# EAGLE design makey_makey_modify_v2 (EAGLE 7.2.0)
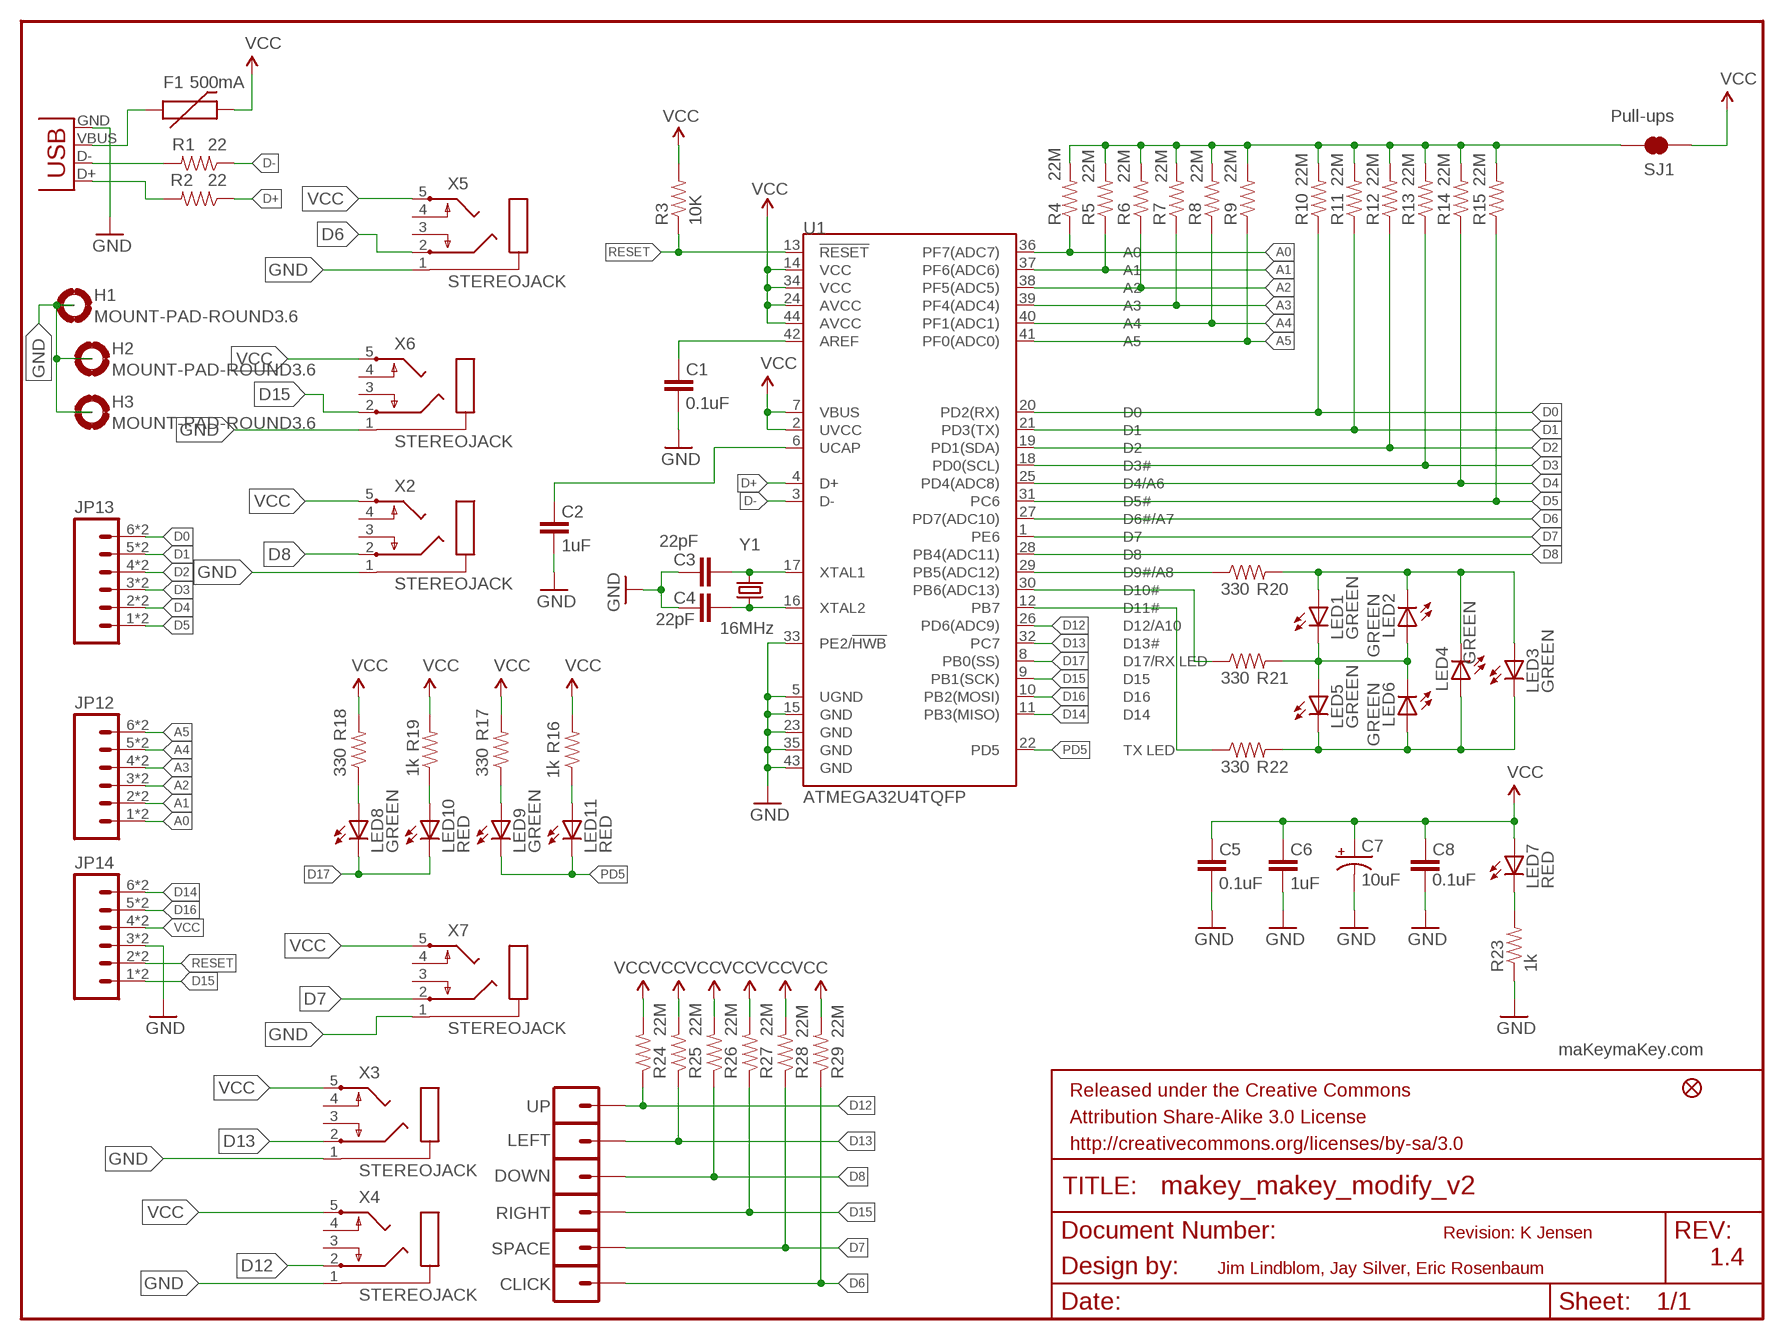
[diagram p0: schematic, sheet 1]

## Parts
C1  0.1uF  CAP0603-CAP  [0603-CAP]
C2  1uF  CAP0603-CAP  [0603-CAP]
C3  22pF  CAP0603-CAP  [0603-CAP]
C4  22pF  CAP0603-CAP  [0603-CAP]
C5  0.1uF  CAP0603-CAP  [0603-CAP]
C6  1uF  CAP0603-CAP  [0603-CAP]
C7  10uF  CAP_POL1206  [EIA3216]
C8  0.1uF  CAP0603-CAP  [0603-CAP]
CLICK  M01ALLIGATOR-3MM  [1X01_ALLIGATOR_3MM]
DOWN  M01ALLIGATOR-3MM  [1X01_ALLIGATOR_3MM]
F1  500mA  PTCSMD-W  [PTC-1206-WIDE]
H1  MOUNT-PAD-ROUND3.6  [3,6-PAD]
H2  MOUNT-PAD-ROUND3.6  [3,6-PAD]
H3  MOUNT-PAD-ROUND3.6  [3,6-PAD]
JP2  FIDUCIALUFIDUCIAL  [MICRO-FIDUCIAL]
JP12  M06SMD-STRAIGHT-COMBO  [1X06_SMD_STRAIGHT_COMBO]
JP13  M06SMD-STRAIGHT-COMBO  [1X06_SMD_STRAIGHT_COMBO]
JP14  M06SMD-STRAIGHT-COMBO  [1X06_SMD_STRAIGHT_COMBO]
LED1  GREEN  LED1206-BOTTOM  [LED-1206-BOTTOM]
LED2  GREEN  LED1206-BOTTOM  [LED-1206-BOTTOM]
LED3  GREEN  LED1206-BOTTOM  [LED-1206-BOTTOM]
LED4  GREEN  LED1206-BOTTOM  [LED-1206-BOTTOM]
LED5  GREEN  LED1206-BOTTOM  [LED-1206-BOTTOM]
LED6  GREEN  LED1206-BOTTOM  [LED-1206-BOTTOM]
LED7  RED  LED0603  [LED-0603]
LED8  GREEN  LED0603  [LED-0603]
LED9  GREEN  LED0603  [LED-0603]
LED10  RED  LED0603  [LED-0603]
LED11  RED  LED0603  [LED-0603]
LEFT  M01ALLIGATOR-3MM  [1X01_ALLIGATOR_3MM]
R1  22  RESISTOR0603-RES  [0603-RES]
R2  22  RESISTOR0603-RES  [0603-RES]
R3  10K  RESISTOR0603-RES  [0603-RES]
R4  22M  RESISTOR0603-RES  [0603-RES]
R5  22M  RESISTOR0603-RES  [0603-RES]
R6  22M  RESISTOR0603-RES  [0603-RES]
R7  22M  RESISTOR0603-RES  [0603-RES]
R8  22M  RESISTOR0603-RES  [0603-RES]
R9  22M  RESISTOR0603-RES  [0603-RES]
R10  22M  RESISTOR0603-RES  [0603-RES]
R11  22M  RESISTOR0603-RES  [0603-RES]
R12  22M  RESISTOR0603-RES  [0603-RES]
R13  22M  RESISTOR0603-RES  [0603-RES]
R14  22M  RESISTOR0603-RES  [0603-RES]
R15  22M  RESISTOR0603-RES  [0603-RES]
R16  1k  RESISTOR0603-RES  [0603-RES]
R17  330  RESISTOR0603-RES  [0603-RES]
R18  330  RESISTOR0603-RES  [0603-RES]
R19  1k  RESISTOR0603-RES  [0603-RES]
R20  330  RESISTOR0603-RES  [0603-RES]
R21  330  RESISTOR0603-RES  [0603-RES]
R22  330  RESISTOR0603-RES  [0603-RES]
R23  1k  RESISTOR0603-RES  [0603-RES]
R24  22M  RESISTOR0603-RES  [0603-RES]
R25  22M  RESISTOR0603-RES  [0603-RES]
R26  22M  RESISTOR0603-RES  [0603-RES]
R27  22M  RESISTOR0603-RES  [0603-RES]
R28  22M  RESISTOR0603-RES  [0603-RES]
R29  22M  RESISTOR0603-RES  [0603-RES]
RIGHT  M01ALLIGATOR-3MM  [1X01_ALLIGATOR_3MM]
SJ1  Pull-ups  SOLDERJUMPER-OLDTRACE  [SJ_2S-TRACE]
SPACE  M01ALLIGATOR-3MM  [1X01_ALLIGATOR_3MM]
U1  ATMEGA32U4TQFP  [TQFP44]
UP  M01ALLIGATOR-3MM  [1X01_ALLIGATOR_3MM]
X1  USBSMD  [USB-MINIB]
X2  STEREOJACK  [STX3100]
X3  STEREOJACK  [STX3100]
X4  STEREOJACK  [STX3100]
X5  STEREOJACK  [STX3100]
X6  STEREOJACK  [STX3100]
X7  STEREOJACK  [STX3100]
Y1  16MHz  CRYSTAL5X3  [CRYSTAL-SMD-5X3]

## Nets
A0: JP12.1 JP12.1-2 R4.1 U1.36(PF7(ADC7))
A1: JP12.2 JP12.2-2 R5.1 U1.37(PF6(ADC6))
A2: JP12.3 JP12.3-2 R6.1 U1.38(PF5(ADC5))
A3: JP12.4 JP12.4-2 R7.1 U1.39(PF4(ADC4))
A4: JP12.5 JP12.5-2 R8.1 U1.40(PF1(ADC1))
A5: JP12.6 JP12.6-2 R9.1 U1.41(PF0(ADC0))
AREF: C1.2 U1.42(AREF)
D0: JP13.6 JP13.6-2 R10.1 U1.20(PD2(RX))
D1: JP13.5 JP13.5-2 R11.1 U1.21(PD3(TX))
D2: JP13.4 JP13.4-2 R12.1 U1.19(PD1(SDA))
D3: JP13.3 JP13.3-2 R13.1 U1.18(PD0(SCL))
D4: JP13.2 JP13.2-2 R14.1 U1.25(PD4(ADC8))
D5: JP13.1 JP13.1-2 R15.1 U1.31(PC6)
D6: CLICK.1@0 CLICK.1@2 R29.1 U1.27(PD7(ADC10)) X5.2
D7: R28.1 SPACE.1@0 SPACE.1@2 U1.1(PE6) X7.2
D8: DOWN.1@0 DOWN.1@2 R26.1 U1.28(PB4(ADC11)) X2.2
D9: R20.1 U1.29(PB5(ADC12))
D10: R21.1 U1.30(PB6(ADC13))
D11: R22.1 U1.12(PB7)
D12: R24.1 U1.26(PD6(ADC9)) UP.1@0 UP.1@2 X4.2
D13: LEFT.1@0 LEFT.1@2 R25.1 U1.32(PC7) X3.2
D14: JP14.6 JP14.6-2 U1.11(PB3(MISO))
D15: JP14.1 JP14.1-2 R27.1 RIGHT.1@0 RIGHT.1@2 U1.9(PB1(SCK)) X6.2
D16: JP14.5 JP14.5-2 U1.10(PB2(MOSI))
D17: LED8.C LED10.C U1.8(PB0(SS))
D+: R2.1 U1.4(D+)
D-: R1.1 U1.3(D-)
GND [vcc]: C1.1 C2.1 C3.2 C4.2 C5.1 C6.1 C7.C(-) C8.1 JP14.3 JP14.3-2 R23.1 U1.5(UGND) U1.15(GND) U1.23(GND) U1.33(PE2/!HWB) U1.35(GND) U1.43(GND) X1.GND X2.1 X3.1 X4.1 X5.1 X6.1 X7.1
N$1: C4.1 U1.16(XTAL2) Y1.1
N$2: C3.1 U1.17(XTAL1) Y1.3
N$3: LED8.A R18.1
N$4: C2.2 U1.6(UCAP)
N$5: F1.1 X1.VBUS
N$6: R1.2 X1.D-
N$7: LED7.C R23.2
N$8: R2.2 X1.D+
N$9: LED11.A R16.1
N$10: LED10.A R19.1
N$11: LED9.A R17.1
N$24: LED1.C LED2.A LED5.A LED6.C R21.2
N$25: LED1.A LED2.C LED3.A LED4.C R20.2
N$26: LED3.C LED4.A LED5.C LED6.A R22.2
PD5: LED9.C LED11.C U1.22(PD5)
PULL-UP: R4.2 R5.2 R6.2 R7.2 R8.2 R9.2 R10.2 R11.2 R12.2 R13.2 R14.2 R15.2 SJ1.2
RESET: JP14.2 JP14.2-2 R3.1 U1.13(!RESET)
VCC: C5.2 C6.2 C7.A(+) C8.2 F1.2 JP14.4 JP14.4-2 LED7.A R3.2 R16.2 R17.2 R18.2 R19.2 R24.2 R25.2 R26.2 R27.2 R28.2 R29.2 SJ1.1 U1.2(UVCC) U1.7(VBUS) U1.14(VCC) U1.24(AVCC) U1.34(VCC) U1.44(AVCC) X2.5 X3.5 X4.5 X5.5 X6.5 X7.5
Unconnected: H1.B3,6(MOUNT) H2.B3,6(MOUNT) H3.B3,6(MOUNT) X2.3 X2.4 X3.3 X3.4 X4.3 X4.4 X5.3 X5.4 X6.3 X6.4 X7.3 X7.4

## Notes on the sheet
- maKeymaKey.com
- Revision: K Jensen
- 1.4
- Jim Lindblom, Jay Silver, Eric Rosenbaum

## Library data of the parts
C1-C6 C8 = SparkFun:CAP: Capacitor Standard 0603 ceramic capacitor, and 0.1" leaded capacitor.
C7 = SparkFun:CAP_POL: Capacitor Polarized These are standard SMD and PTH capacitors. Normally 10uF, 47uF, and 100uF in electrolytic and tantalum varieties. Always verify the external diameter of the through hole cap, it varies with capacity, voltage, and manufacturer. The EIA devices should be standard.
CLICK DOWN LEFT RIGHT SPACE UP = SparkFun-Connectors:M01: Header 1 Standard 1-pin 0.1" header. Use with straight break away headers (SKU : PRT-00116), right angle break away headers (PRT-00553), swiss pins (PRT-00743), machine pins (PRT-00117), and female headers (PRT-00115).
F1 = SparkFun-PowerIC:PTC: Resettable Fuse PTC Resettable Fuse. Spark Fun Electronics SKU : COM-08357
H1-H3 = holes:MOUNT-PAD-ROUND: MOUNTING PAD, round
JP2 = SparkFun:FIDUCIAL: Fiducial Alignment Points Various fiducial points for machine vision alignment.
JP12-JP14 = SparkFun-Connectors:M06: Header 6 Standard 6-pin 0.1" header. Use with straight break away headers (SKU : PRT-00116), right angle break away headers (PRT-00553), swiss pins (PRT-00743), machine pins (PRT-00117), and female headers (PRT-00115). Molex polarized connector foot print use with SKU : PRT-08094 with associated crimp pins and housings. NOTES ON THE VARIANTS LOCK and LOCK_LONGPADS... This footprint was designed to help hold the alignment of a through-hole component (i.e. 6-pin header) while soldering it into place. You may notice that each hole has been shifted either up or down by 0.005 of an inch from it's more standard position (which is a perfectly straight line). This slight alteration caused the pins (the squares in the middle) to touch the edges of the holes. Because they are alternating, it causes a "brace" to hold the component in place. 0.005 has proven to be the perfect amount of "off-center" position when using our standard breakaway headers. Although looks a little odd when you look at the bare footprint, once you have a header in there, the alteration is very hard to notice. Also, if you push a header all the way into place, it is covered up entirely on the bottom side. This idea of altering the position of holes to aid alignment will be further integrated into the Sparkfun Library for other footprints. It can help hold any component with 3 or more connection pins.
LED1-LED6 LED8-LED11 = SparkFun-LED:LED: LEDs Standard schematic elements and footprints for 5mm, 3mm, 1206, and 0603 sized LEDs. 5mm - Spark Fun Electronics SKU : COM-00529 (and others)
LED7 = SparkFun:LED: LEDs Standard schematic elements and footprints for 5mm, 3mm, 1206, and 0603 sized LEDs. 5mm - Spark Fun Electronics SKU : COM-00529 (and others)
R1-R15 R23-R29 = SparkFun:RESISTOR: Resistor Basic schematic elements and footprints for 0603, 1206, and PTH resistors.
R16-R22 = SparkFun-Passives:RESISTOR: Resistor Basic schematic elements and footprints for 0603, 1206, and PTH resistors.
SJ1 = SparkFun:SOLDERJUMPER-OLD: Solder Jumper Standard SMD solder jumper. Used to automate production. Two varients : Normally Open and Normally Closed are the same, but have different paste layers. NC will have a large amount of paste and should jumper during reflow.
U1 = SparkFun-DigitalIC:ATMEGA32U4: Atmel 44-pin 8-bit Microcontroller with 32KBytes of ISP Flash and USB Controller
X1 = SparkFun:USB: USB Connectors USB-B-PTH is fully proven SKU : PRT-00139 USB-miniB is fully proven SKU : PRT-00587 USB-A-PCB is untested. USB-A-H is throughly reviewed, but untested. Spark Fun Electronics SKU : PRT-00437 USB-B-SMT is throughly reviewed, but untested. Needs silkscreen touching up. USB-A-S has not been used/tested USB-MB-H has not been used/tested
X2-X7 = adafruit:STEREOJACK: MIC/HEADPHONE JACK Stereo jack with two switches. Kycon STX3100, CUI SJ1-3555NG and/or 4UCon 05544
Y1 = SparkFun:CRYSTAL: Crystals Various standard crystals. Proven footprints. Spark Fun Electronics SKU : COM-00534

## Net classes
0 default: width 0.203 mm

## Board
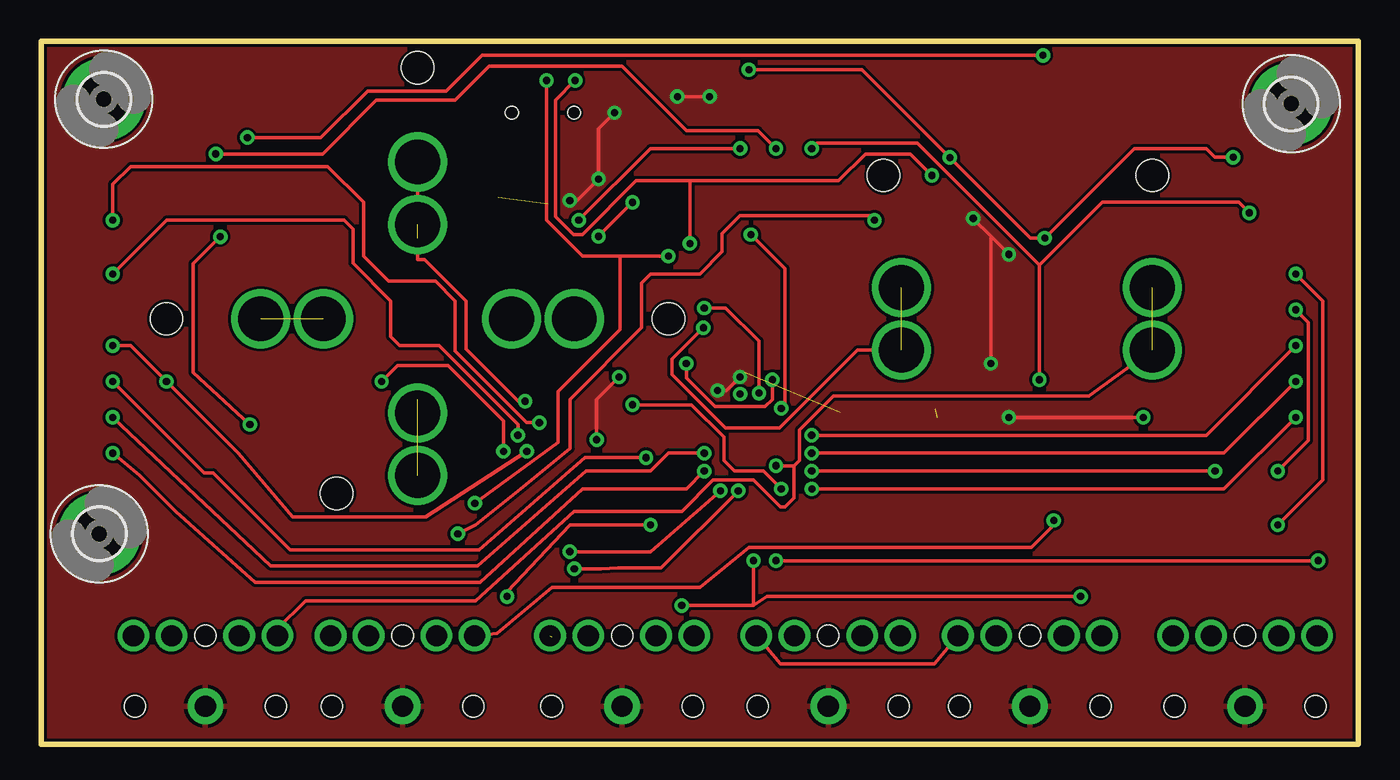
[diagram p1: board, top side]
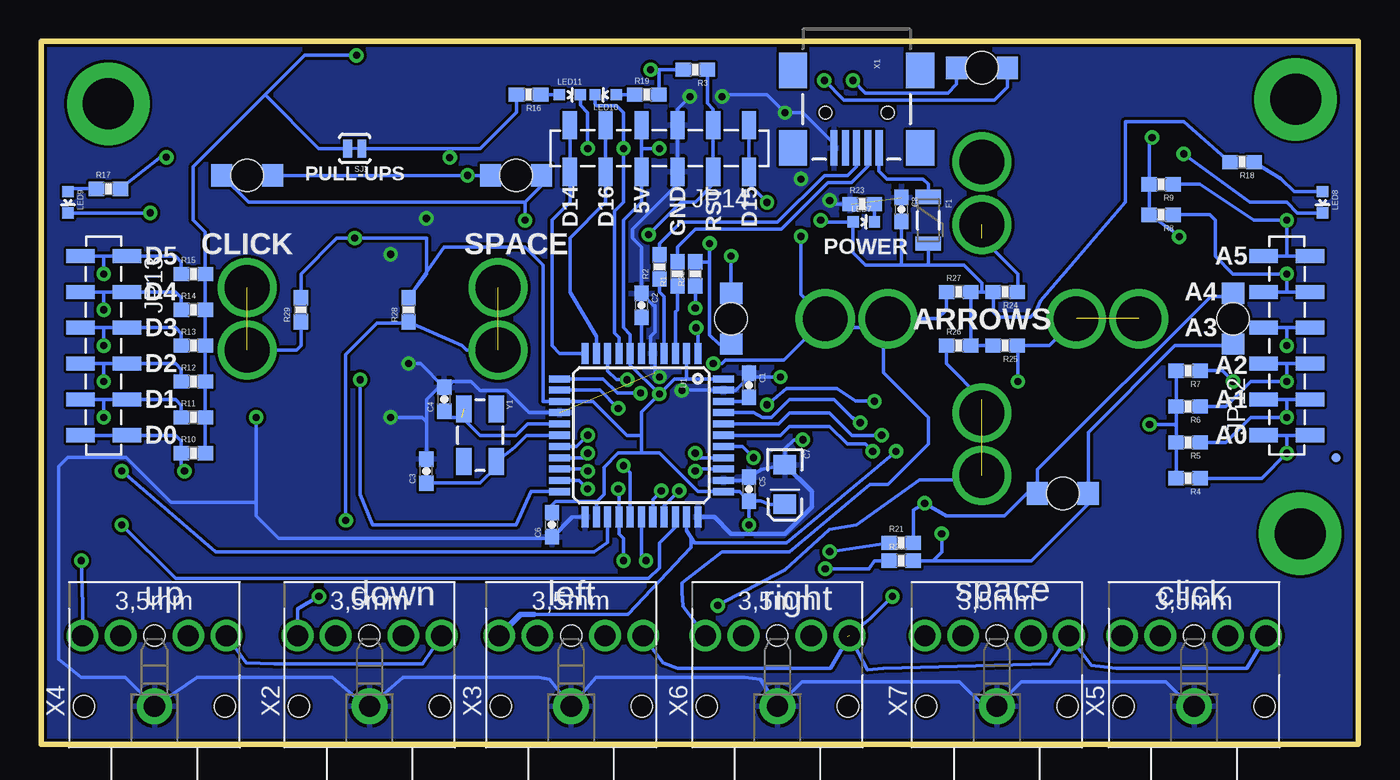
[diagram p2: board, bottom side, seen from below]

Size 93.34 x 49.85 mm. Coordinates in mm from the lower left corner, seen from the top.
Outline: 0,49.85 93.34,49.85 93.34,0 0,0 0,49.85
Copper layers (1*16): Top 0.035mm / dielectric 1.5mm / Bottom 0.035mm
Design rules "SparkFun-2-layer *": minimum track width 1mil, minimum drill 15mil, track to track 8mil, track to pad 8mil, pad to pad 8mil, via to via 8mil, smd to smd 8mil, copper to edge 8mil, drill to drill 8mil, minimum pad ring 12mil, minimum via ring 10mil, stop-mask expansion 4mil, vias tented up to drill 20mil, thermal gap 10mil

### Footprints (pad centres in the part's own frame; a part is rotated, then mirrored left to right if it is on the bottom)
0603-CAP = smd 1.1 x 1: 1 -0.85,0; 2 0.85,0
EIA3216 = smd 1.4 x 1.6: A 1.4,0; C -1.4,0
1X01_ALLIGATOR_3MM = drill 3.175: 1@0 0,2.223; 1@2 0,-2.223
PTC-1206-WIDE = smd 1 x 1.8: 1 -1.654,0; 2 1.654,0
3,6-PAD = drill 3.6 pad 5.842: B3,6 0,0
MICRO-FIDUCIAL = smd 0.635 x 0.635: 1 0,0
1X06_SMD_STRAIGHT_COMBO = smd 1 x 2: 1 0,-1.65; 1-2 0,1.65; 2 2.54,1.65; 2-2 2.54,-1.65; 3 5.08,-1.65; 3-2 5.08,1.65; 4 7.62,1.65; 4-2 7.62,-1.65; 5 10.16,-1.65; 5-2 10.16,1.65; 6 12.7,1.65; 6-2 12.7,-1.65
LED-1206-BOTTOM = smd 1.5 x 1.6: A -1.8,0; C 1.8,0 | hole 2.3: 0,0
LED-0603 = smd 0.8 x 0.8: A 0,-0.75; C 0,0.75
0603-RES = smd 1.1 x 1: 1 -0.85,0; 2 0.85,0
SJ_2S-TRACE = smd 0.635 x 1.27: 1 -0.508,0; 2 0.508,0
TQFP44 = smd 1.5 x 0.5: 1 -5.8,4; 2 -5.8,3.2; 3 -5.8,2.4; 4 -5.8,1.6; 5 -5.8,0.8; 6 -5.8,0; 7 -5.8,-0.8; 8 -5.8,-1.6; 9 -5.8,-2.4; 10 -5.8,-3.2; 11 -5.8,-4; 23 5.8,-4; 24 5.8,-3.2; 25 5.8,-2.4; 26 5.8,-1.6; 27 5.8,-0.8; 28 5.8,0; 29 5.8,0.8; 30 5.8,1.6; 31 5.8,2.4; 32 5.8,3.2; 33 5.8,4 | smd 0.5 x 1.5: 12 -4,-5.8; 13 -3.2,-5.8; 14 -2.4,-5.8; 15 -1.6,-5.8; 16 -0.8,-5.8; 17 0,-5.8; 18 0.8,-5.8; 19 1.6,-5.8; 20 2.4,-5.8; 21 3.2,-5.8; 22 4,-5.8; 34 4,5.8; 35 3.2,5.8; 36 2.4,5.8; 37 1.6,5.8; 38 0.8,5.8; 39 0,5.8; 40 -0.8,5.8; 41 -1.6,5.8; 42 -2.4,5.8; 43 -3.2,5.8; 44 -4,5.8
USB-MINIB = smd 2.5 x 0.5: D+ 2.5,0; D- 2.5,0.8; GND 2.5,-1.6; ID 2.5,-0.8; VBUS 2.5,1.6 | smd 2.5 x 2: MTN1 -3,4.5; MTN2 2.5,4.5; MTN3 -3,-4.5; MTN4 2.5,-4.5 | hole 0.9: 0,2.2; 0,-2.2
STX3100 = drill 1.5 pad 2.54: 1 2.7,-0.1 | drill 1.5: 2 7.7,5; 3 7.7,2.3; 4 7.7,-2.5; 5 7.7,-5.2 | hole 1.5: 2.7,4.9; 2.7,-5.1; 7.7,-0.1
CRYSTAL-SMD-5X3 = smd 1.9 x 1.1: 1 -1.85,-1.15; 2 1.85,-1.15; 3 1.85,1.15; 4 -1.85,1.15

### Placement (x,y rotation side)
C1  43.18,25.46 270 bottom
C2  50.8,31.11 270 bottom
C3  66.04,19.37 90 bottom
C4  64.77,24.45 90 bottom
C5  43.18,18.1 270 bottom
C6  57.15,15.56 90 bottom
C7  40.64,18.41 270 bottom
C8  32.38,37.91 270 bottom
CLICK  78.74,30.16 180 bottom
DOWN  26.67,21.27 0 top
F1  30.48,37.15 270 bottom
H1  4.13,14.92 0 top
H2  4.45,45.72 0 top
H3  88.58,45.4 0 top
JP2  1.59,20.32 0 bottom
JP12  5.08,21.91 90 bottom
JP13  88.9,34.61 270 bottom
JP14  43.18,42.23 180 bottom
LED1  20.96,17.78 180 bottom
LED2  8.89,30.16 270 bottom
LED3  78.74,40.32 0 bottom
LED4  59.69,40.32 0 bottom
LED5  26.67,47.94 0 bottom
LED6  44.45,30.16 90 bottom
LED7  35.05,37.02 270 bottom
LED8  2.54,38.42 180 bottom
LED9  91.44,38.42 180 bottom
LED10  53.34,46.04 90 bottom
LED11  55.88,46.04 270 bottom
LEFT  17.78,30.16 270 top
R1  48.26,33.34 90 bottom
R2  49.53,33.85 90 bottom
R3  46.99,47.82 180 bottom
R4  12.06,18.86 180 bottom
R5  12.06,21.4 180 bottom
R6  12.06,23.94 180 bottom
R7  12.06,26.48 180 bottom
R8  13.97,37.53 180 bottom
R9  13.97,39.69 180 bottom
R10  82.55,20.64 0 bottom
R11  82.55,23.18 0 bottom
R12  82.55,25.72 0 bottom
R13  82.55,28.26 0 bottom
R14  82.55,30.8 0 bottom
R15  82.55,33.34 0 bottom
R16  58.8,46.04 180 bottom
R17  88.58,39.37 0 bottom
R18  8.25,41.27 180 bottom
R19  50.42,46.04 0 bottom
R20  32.38,13.02 0 bottom
R21  32.38,14.29 0 bottom
R22  46.99,33.34 90 bottom
R23  35.18,38.29 0 bottom
R24  25.02,32.07 180 bottom
R25  25.02,28.26 180 bottom
R26  28.32,28.26 0 bottom
R27  28.32,32.07 0 bottom
R28  67.31,30.8 90 bottom
R29  74.93,30.8 90 bottom
RIGHT  35.56,30.16 270 top
SJ1  71.12,42.23 180 bottom
SPACE  60.96,30.16 180 bottom
U1  50.8,21.91 270 bottom
UP  26.67,39.05 0 top
X1  35.56,44.77 270 bottom
X2  70.17,0 90 bottom
X3  55.88,0 90 bottom
X4  85.41,0 90 bottom
X5  11.75,0 90 bottom
X6  41.27,0 90 bottom
X7  25.72,0 90 bottom
Y1  62.23,21.91 270 bottom

### Tracks (layer width: path | path; a pad name or v marks a point on that pad's centre or on a via)
A0  (via drill 0.51)
  Top 0.254: v46.99,19.37 45.72,18.1 38.35,18.1 31.12,11.49 15.18,11.49 9.52,16.51 6.99,19.05 v5.08,20.64
  Bottom 0.254: JP12.1-2 5.08,21.91 | 5.08,21.91 JP12.1 | U1.36 46.85,19.51 v46.99,19.37 | 5.08,21.91 v5.08,20.64 6.86,18.86 R4.1
A1  (via drill 0.51)
  Top 0.254: v46.99,20.64 44.45,20.64 43.18,19.37 38.61,19.37 30.92,12.64 16.26,12.64 v5.08,23.18
  Bottom 0.254: JP12.2-2 5.08,24.45 | 5.08,24.45 JP12.2 | U1.37 46.66,20.31 v46.99,20.64 | 5.08,24.45 v5.08,23.18 7.62,23.18 9.4,21.4 R5.1
A2  (via drill 0.51)
  Top 0.254: v42.86,20.32 38.54,20.32 31.05,13.78 17.65,13.78 12.19,19.24 11.56,19.24 v5.08,25.72
  Bottom 0.254: JP12.3-2 5.08,26.99 | 5.08,26.99 JP12.3 | U1.38 43.65,21.11 v42.86,20.32 | 5.08,26.99 v5.08,25.72 7.62,25.72 9.4,23.94 R6.1
A3  (via drill 0.51)
  Top 0.254: v34.42,20.77 27.24,16.13 17.84,16.13 13.97,20.64 v8.89,25.72 6.35,28.26 v5.08,28.26
  Bottom 0.254: JP12.4 5.08,29.53 | 5.08,29.53 JP12.4-2 | v34.42,20.77 34.92,21.27 36.2,21.27 37.46,22.54 40.32,22.54 40.96,21.91 U1.39 | v5.08,28.26 5.08,29.53 | R7.1 9.65,26.48 v8.89,25.72
A4  (via drill 0.51)
  Top 0.254: v5.08,33.34 8.89,37.15 21.46,37.15 22.1,36.51 22.1,34.1 24.76,31.43 24.76,28.89 25.4,28.26 28.19,28.26 33.78,22.67 v33.78,21.91
  Bottom 0.254: JP12.5-2 5.08,32.07 | 5.08,32.07 JP12.5 | 5.08,32.07 v5.08,33.34 8.89,33.34 10.16,34.61 10.16,37.15 10.54,37.53 R8.1 | U1.40 41.11,22.71 40.32,23.5 37.46,23.5 35.88,21.91 v33.78,21.91
A5  (via drill 0.51)
  Top 0.254: v5.08,37.15 5.08,39.69 6.35,40.96 20.32,40.96 22.86,38.42 22.86,34.61 24.64,32.83 27.94,32.83 29.34,31.43 29.34,27.88 34.42,22.8 v35.31,22.8
  Bottom 0.254: JP12.6 5.08,34.61 | 5.08,34.61 JP12.6-2 | 5.08,34.61 v5.08,37.15 7.43,37.15 11.24,39.69 R9.1 | U1.41 42.88,23.51 42.23,23.18 41.59,23.18 40.32,24.45 37.15,24.45 35.88,23.18 v35.31,22.8
AREF
  Bottom 0.254: 43.18,24.45 C1.2 43.49,24.31 U1.42
D0  (via drill 0.51)
  Top 0.254: v54.61,19.37 v83.18,19.37
  Bottom 0.254: U1.20 54.75,19.51 v54.61,19.37 | JP13.6-2 JP13.6 83.82,21.91 83.4,21.49 R10.1 83.4,19.58 v83.18,19.37
D1  (via drill 0.5)
  Top 0.254: v88.9,23.18 83.82,18.1 v54.61,18.1
  Bottom 0.254: R11.1 83.4,24.03 83.82,24.45 JP13.5-2 88.9,24.45 | 88.9,24.45 v88.9,23.18 | v54.61,18.1 55.22,18.71 U1.21 | JP13.5 88.9,24.45
D2  (via drill 0.51)
  Top 0.254: v54.61,20.64 83.82,20.64 v88.9,25.72
  Bottom 0.254: U1.19 54.94,20.31 v54.61,20.64 | v88.9,25.72 88.9,26.99 | 88.9,26.99 JP13.4-2 | 88.9,26.99 JP13.4 83.82,26.99 83.4,26.57 R12.1
D3  (via drill 0.51)
  Top 0.254: v88.9,28.26 82.55,21.91 v54.61,21.91
  Bottom 0.254: U1.18 55.41,21.11 v54.61,21.91 | 88.9,29.53 JP13.3-2 83.82,29.53 83.4,29.11 R13.1 | 88.9,29.53 JP13.3 | v88.9,28.26 88.9,29.53
D4  (via drill 0.51)
  Top 0.254: v87.63,19.37 89.79,21.53 89.79,29.91 v88.9,30.8
  Bottom 0.254: 88.9,32.07 JP13.2 83.82,32.07 83.4,31.65 R14.1 | 88.9,32.07 JP13.2-2 | v87.63,19.37 80.96,13.65 54.17,13.65 53.2,14.3 U1.25 | v88.9,30.8 88.9,32.07
D5  (via drill 0.51)
  Top 0.254: v87.63,15.56 90.81,18.73 90.81,31.43 v88.9,33.34
  Bottom 0.254: v87.63,15.56 83.82,11.75 50.29,11.75 49.53,12.51 49.53,14.29 48.4,15.42 U1.31 | 88.9,34.61 JP13.1-2 83.82,34.61 83.4,34.19 R15.1 | 88.9,34.61 JP13.1 | v88.9,33.34 88.9,34.61
D6  (via drill 0.51)  (1 unrouted)
  Top 0.254: v52.07,19.75 53.34,19.75 | 53.34,19.75 53.72,20.13 53.72,22.29 56.13,24.7 74.23,24.7 CLICK.1@0 | X5.2 16.75,8.18 18.73,10.16 30.8,10.16 37.78,16.51 45.4,16.51 47.63,18.73 50.48,18.73 52.39,16.83 52.71,16.83 53.34,17.46 53.34,19.75
  Bottom 0.254: U1.27 51.6,19.28 v52.07,19.75 | R29.1 74.93,28.26 75.25,27.94 CLICK.1@0
D7  (via drill 0.51)  (1 unrouted)
  Top 0.254: v46.93,29.53 44.7,27.3 44.7,26.23 48.51,22.42 52.32,22.42 57.85,27.94 SPACE.1@0 | X7.2 32.31,7.86 36.2,11.11 46.67,11.11 50.17,13.97 70.17,13.97 71.76,15.56 v71.76,15.88
  Bottom 0.254: U1.1 46.8,29.4 v46.93,29.53 | SPACE.1@0 63.18,27.94 63.5,28.26 R28.1 67.41,29.84 69.53,29.84 71.76,27.62 v71.76,15.88
D8  (via drill 0.51)  (2 unrouted)
  Top 0.254: v73.66,10.48 51.43,10.48 50.48,9.84 | 50.48,9.84 v45.4,9.84 | v50.48,13.02 50.48,9.84
  Bottom 0.254: 26.67,24.45 29.21,26.99 29.21,28.22 R26.1 | X2.2 75.17,9.61 v73.66,10.48 | v45.4,9.84 40.64,12.38 37.46,15.24 35.56,15.56 31.12,18.73 26.99,18.73 DOWN.1@2 | U1.28 50.8,13.34 v50.48,13.02
D9  (via drill 0.51)
  Top 0.254: v49.4,17.97 43.94,12.51 40.89,12.51 39.69,12.45 v37.78,12.45
  Bottom 0.254: U1.29 50,17.37 v49.4,17.97 | v37.78,12.45 34.67,12.45 34.29,13.02 R20.1
D10  (via drill 0.51)
  Top 0.254: v48.13,17.97 43.18,13.65 v37.46,13.65
  Bottom 0.254: U1.30 49.2,16.9 v48.13,17.97 | R21.1 v37.46,13.65
D11  (via drill 0.51)
  Top 0.254: v50.86,24.89 50.86,28.57 48.51,30.92 v46.99,30.92
  Bottom 0.254: U1.12 53.53,25.91 52.51,24.89 v50.86,24.89 | v46.99,30.92 R22.1
D12  (via drill 0.51)  (1 unrouted)
  Top 0.254: v52.45,18.1 51.18,19.37 49.15,19.37 48.39,20.13 48.39,21.78 46.1,24.07 v41.91,24.07 | v34.29,24.32 33.78,24.32 30.1,28 30.1,31.43 27.18,34.35 26.67,34.35 UP.1@2 UP.1@0 | v90.49,13.02 v52.07,13.02
  Bottom 0.254: v52.45,18.1 52.4,18.05 U1.26 52.39,16.09 52.39,14.92 52.07,14.61 v52.07,13.02 | v41.91,24.07 40.51,25.21 36.96,25.21 35.62,24.32 v34.29,24.32 | 26.67,35.88 24.13,33.34 24.13,32.11 R24.1 | X4.2 90.41,9.92 v90.49,13.02
D13  (via drill 0.5, 0.51)  (1 unrouted)
  Top 0.254: v32.77,20.77 32.77,22.92 28.83,26.86 25.27,26.86 v24.13,25.72
  Bottom 0.254: U1.32 47.6,15.15 47.05,14.29 | 47.05,14.29 40.51,14.29 v32.77,20.77 | LEFT.1@0 21.91,28.26 R25.1 24.13,28.22 v24.13,25.72 | 58.42,9.21 51.75,9.21 47.31,13.97 47.31,14.67 47.05,14.29
  Bottom 0.406: 58.42,9.21 59.37,9.21 X3.2
D14
  Bottom 0.254: JP14.6 JP14.6-2 | JP14.6 55.88,43.5 | JP14.6 55.88,38.42 57.15,37.15 57.15,28.26 56.6,27.71 U1.11
D15  (via drill 0.51)
  Top 0.254: v51.82,25.84 51.82,24.45 51.31,23.94 47.75,23.94 45.72,25.97 v45.72,26.99 | v41.91,38.42 v39.5,36.01
  Bottom 0.254: U1.9 53.2,26.47 52.58,25.84 v51.82,25.84 | v45.72,26.99 45.09,26.99 44.83,27.24 40.7,27.24 RIGHT.1@0 | JP14.1 JP14.1-2 43.18,39.69 v41.91,38.42 | v39.5,36.01 39.5,31.88 RIGHT.1@0 | R27.1 29.21,32.03 29.21,30.8 29.85,30.16 RIGHT.1@2 | RIGHT.1@0 37.78,29.84 38.1,29.53 33.97,29.53 RIGHT.1@2 | X6.2 47.86,9.76 47.94,10.79 47.94,11.43 45.09,13.65 40.32,13.65 34.61,18.41 33.34,18.41 30.48,21.27 30.48,23.18 33.65,26.35 33.65,29.84 RIGHT.1@2
D16
  Bottom 0.203: JP14.5 53.21,43.88
  Bottom 0.254: JP14.5 JP14.5-2 53.34,38.42 55.88,35.88 55.88,32.07 54,28.92 U1.10
D17  (via drill 0.51)
  Top 0.254: v12.38,41.85 19.94,41.85 23.75,45.66 29.34,45.66 31.75,48.07 41.15,48.07 45.72,43.5 50.8,43.5 v52.07,42.23
  Bottom 0.254: U1.8 52.4,28.84 52.71,29.15 52.71,37.78 52.07,38.42 v52.07,42.23 52.07,44.77 52.58,45.28 53.97,45.28 54.09,45.39 LED10.C | LED8.C 4.33,37.67 5.08,38.42 7.68,38.42 v12.38,41.85
D+
  Bottom 0.254: U1.4 49.2,31.74 49.53,32.07 R2.1
D-
  Bottom 0.254: U1.3 48.4,30.66 48.26,30.8 R1.1
GND  (via drill 0.5, 0.51)  (2 unrouted)
  Top 0.254: v37.46,38.54 37.97,38.54 v39.5,40.07 39.5,43.62 v40.64,44.77 | v45.09,45.91 v47.37,45.91 | v66.04,37.27 67.37,35.94 | 67.37,35.94 v68.58,34.73 | v67.31,26.99 67.31,35.88 67.37,35.94 | v47.94,25.08 48.58,25.08 v49.53,26.04 | v78.1,23.18 v68.58,23.18 | v40.96,26.04 39.37,24.45 v39.37,21.59
  Bottom 0.254: U1.35 43.42,18.71 C5.1 42.31,19.5 C7.C 40.64,20.95 40,21.59 v39.37,21.59 | v47.37,45.91 48.26,45.02 JP14.3 JP14.3-2 48.26,39.69 51.43,36.51 51.43,35.88 50.8,35.24 C2.1 49.95,31.11 49.85,31.11 49.85,29.21 50.17,28.89 50.17,27.62 50.08,27.71 U1.5 49.85,27.55 49.85,26.35 v49.53,26.04 | 66.04,22.86 66.04,24.45 65.19,25.3 C4.2 | 66.04,22.86 C3.2 | U1.15 58.75,23.51 60.32,25.08 62.23,25.08 62.86,25.72 64.14,25.72 64.35,25.5 | C4.2 64.35,25.72 64.35,25.5 | U1.23 55.75,16.11 | 55.75,16.11 C6.1 | v45.09,45.91 44.96,46.04 41.91,46.04 v40.64,44.77 39.37,44.77 37.16,42.56 X1.GND | 64.35,25.5 64.77,25.08 | v37.46,38.54 37.21,38.29 R23.1 35.94,38.29 | v47.94,25.08 47.92,25.11 U1.43 44.97,25.08 44.13,25.08 43.18,26.04 | C1.1 43.18,26.04 | v67.31,26.99 66.46,26.99 C4.2 | 55.75,16.11 55.75,16 57.15,14.61 76.52,14.61 78.1,16.19 78.1,17.14 | v68.58,23.18 66.36,23.18 66.04,22.86 | 43.18,26.04 v40.96,26.04 | v78.1,23.18 78.1,17.14 | 78.1,17.14 84.14,17.14 87.31,20.32 91.44,20.32 92.07,19.68 92.07,6.03 90.49,4.76 87.37,4.76 X4.1 82.29,4.76 72.71,4.76 70.32,2.7 X2.1 67.68,4.76 58.1,4.76 57.31,4.61 X3.1 54.03,4.76 43.5,4.76 42.39,4.61 X6.1 39.43,4.45 28.26,4.45 26.51,2.7 X7.1 23.87,4.45 13.65,4.45 12.07,2.86 11.75,2.86 11.65,2.76 X5.1
  Bottom 0.305: U1.33 45.64,16.11 44.45,14.92 40.64,14.92 38.74,16.83 38.74,17.91 C7.C
  pour Bottom: 0,49.85 93.34,49.85 93.34,0 0,0
  pour Top: 0,49.85 93.34,49.85 93.34,0 0,0
N$1  (1 unrouted)
  Bottom 0.254: C4.1 64.35,23.18 63.5,23.18 62.23,21.91 59.69,21.91 58.89,22.71 U1.16
N$2
  Bottom 0.254: U1.17 58.93,21.91 59.81,21.03 Y1.3 61.08,19.67 62.23,18.52 C3.1
N$3
  Bottom 0.254: R18.1 5.5,40.11 4.56,39.17 LED8.A
N$4
  Bottom 0.254: U1.6 C2.2
N$5
  Bottom 0.254: X1.VBUS 33.96,40.63 33.4,40.07 30.86,40.07 30.48,39.69 F1.1
N$6
  Bottom 0.254: X1.D- 34.76,40.99 35.94,39.81 37.59,39.81 40.89,36.51 46.99,36.51 48.26,35.24 R1.2
N$7
  Bottom 0.254: LED7.C 34.3,38.26 R23.2
N$8
  Bottom 0.254: X1.D+ 35.56,40.96 36.2,40.32 37.85,40.32 41.15,37.02 48.01,37.02 49.53,35.5 R2.2
N$9
  Bottom 0.254: LED11.A R16.1
N$10
  Bottom 0.254: R19.1 LED10.A
N$11
  Bottom 0.254: R17.1 91.24,39.37 LED9.A
N$12
  Top 0.406: 0,49.85 93.34,49.85
N$14  (via drill 0.51)
  other vias: 33.02,10.48
N$15  (via drill 0.51)
  other vias: 50.48,13.02
N$16  (via drill 0.51)
  other vias: 39.37,21.59
N$17  (via drill 0.51)
  other vias: 78.11,23.18
N$18  (via drill 0.51)
  other vias: 40.96,26.04
N$21  (via drill 0.51)
  other vias: 29.53,14.92
N$22  (via drill 0.51)
  other vias: 59.05,37.15
N$24  (via drill 0.51)
  Top 0.254: v30.73,17.08 36.64,21.4 36.64,25.02 41.02,29.4 41.02,34.61 | v44.45,34.61 41.02,34.61 | v35.81,47.05 35.81,37.15 38.35,34.61 41.02,34.61
  Bottom 0.254: v44.45,34.61 LED6.C | v35.81,47.05 34.92,46.16 29.08,46.16 28.47,46.78 LED5.A | R21.2 31.53,16.61 v30.73,17.08 29.21,16.19 25.08,16.19 23.49,17.78 LED1.C 22.76,19.47 10.48,31.75 9.1,31.75 LED2.A
N$25  (via drill 0.51)
  Top 0.254: v29.53,14.92 30.8,15.56 33.97,18.1 37.46,20.95 37.46,24.45 42.54,29.53 42.54,32.7 43.18,33.34 46.67,33.34 48.26,34.92 48.26,36.2 49.53,37.47 58.74,37.47 v59.06,37.15
  Bottom 0.254: LED2.C 8.99,28.26 13.02,28.26 19.16,22.12 LED1.A 19.16,17.04 23.18,13.02 R20.2 30.16,13.02 29.53,13.65 v29.53,14.92 | LED4.C 57.89,39.58 59.06,38.42 | 59.06,38.42 78.64,38.42 LED3.A | v59.06,37.15 59.06,38.42
N$26  (via drill 0.51)
  Top 0.254: 45.97,39.94 42.16,39.94 38.35,36.13 37.72,36.13 36.45,37.4 36.45,45.66 v37.85,47.05 | 45.97,39.94 56.52,39.94 58.42,41.85 61.6,41.85 v63.12,40.32 | v45.97,35.5 45.97,39.94
  Bottom 0.254: v45.97,35.5 45.97,34.23 | 45.97,34.23 45.97,29.02 45.32,28.36 LED6.A | v37.85,47.05 36.45,45.66 25.78,45.66 24.87,46.57 LED5.C | LED4.A v63.12,40.32 LED3.C | R22.2 46.01,34.19 45.97,34.23
PD5  (via drill 0.51)
  Top 0.254: 70.74,33.97 62.1,42.61 54.99,42.61 v54.61,42.23 | v85.61,37.67 84.86,38.42 75.18,38.42 70.74,33.97 | 70.74,33.97 v70.74,25.84
  Bottom 0.254: LED9.C v85.61,37.67 | LED11.C 55.13,45.29 54.61,44.77 v54.61,42.23 | U1.22 58.61,17.91 59.69,15.56 69.85,15.56 70.74,17.72 v70.74,25.84
PULL-UP  (via drill 0.51)
  Top 0.254: v70.99,48.83 31.24,48.83 28.72,46.31 23.13,46.31 19.83,43.01 v14.62,43.01 | v12.7,35.98 10.8,34.07 10.8,26.35 v14.8,22.67
  Bottom 0.254: R10.2 R11.2 R12.2 R13.2 R14.2 R15.2 81.7,36.3 82.55,37.15 82.55,40.96 77.47,46.04 | 77.47,46.04 74.68,48.83 v70.99,48.83 | SJ1.2 73.66,42.23 77.47,46.04 | R7.2 R6.2 12.91,22.54 | 12.91,22.54 R5.2 R4.2 | v14.8,22.67 13.04,22.67 12.91,22.54 | v14.62,43.01 14.82,42.8 R9.2 R8.2 12.91,36.19 v12.7,35.98
RESET  (via drill 0.51)
  Top 0.254: v50.29,36.13 52.71,33.72 52.71,24.07 v52.45,23.81
  Bottom 0.254: U1.13 53.75,25.11 v52.45,23.81 | v50.29,36.13 48.01,38.42 46.99,38.42 45.72,39.69 JP14.2 JP14.2-2 45.72,45.02 46.14,45.44 R3.1
VCC  (via drill 0.51)  (1 unrouted)
  Top 0.254: v38.1,37.15 43.18,42.23 v49.53,42.23 | v84.47,41.61 83.17,41.61 82.55,42.23 77.47,42.23 v71.12,35.88 70.1,35.88 v64.39,41.59 58.17,47.82 v50.15,47.82 | X3.5 50.68,7.74 52.39,5.71 63.3,5.71 X2.5 | v33.02,10.48 33.02,10.79 37.46,15.56 v43.18,15.56
  Bottom 0.254: 50.8,20.64 50.8,21.91 | v49.53,24.83 51.6,26.9 U1.7 | U1.44 47.63,25.91 | 47.63,25.91 48.45,25.91 v49.53,24.83 | U1.2 47.6,25.93 47.63,25.91 | C7.A 41.78,17.02 42.33,17.25 C5.2 | 50.8,21.91 51.82,21.91 54.22,24.31 U1.14 57.78,24.31 57.78,33.97 59.06,35.24 64.77,35.24 R28.2 | 50.8,20.64 52.45,20.64 53.47,19.62 53.47,17.72 54,17.18 | U1.24 54,17.18 | U1.7 51.6,28.3 | U1.7 51.6,29.06 52.07,29.53 52.07,37.15 50.8,38.42 JP14.4 50.8,42.23 | 30.48,33.97 27.94,33.97 26.67,32.7 26.67,32.07 | 30.48,33.97 32.39,33.97 | 32.39,33.97 34.92,33.97 35.8,34.85 LED7.A 37.97,37.02 v38.1,37.15 | C6.2 57.15,16.95 56.9,17.21 54,17.21 54,17.18 | 50.8,21.91 50.8,23.56 v49.53,24.83 | 50.8,20.64 49.53,20.64 46.8,17.91 U1.34 43.84,17.91 C5.2 | 50.8,42.23 JP14.4-2 50.67,43.88 | v49.53,42.23 50.8,42.23 | R28.2 66.04,33.34 66.04,35.88 v71.12,35.88 72.39,35.88 74.93,33.34 R29.2 | R3.2 49.53,47.82 | 49.53,47.82 v50.15,47.82 | v64.39,41.59 64.39,42.23 | 64.39,42.23 62.23,42.23 59.65,44.81 R16.2 | 64.39,42.23 SJ1.1 | R17.2 84.67,41.81 v84.47,41.61 | R19.2 49.57,47.78 49.53,47.82 | R25.2 R26.2 R27.2 26.67,32.07 | 26.67,32.07 R24.2 25.87,30.63 25.53,30.29 23.24,30.29 22.86,30.67 22.54,31.43 16.51,38.42 16.51,44.13 12.38,44.13 R18.2 | F1.2 30.48,33.97 | C8.2 32.39,33.97 | 67.65,31.3 R28.2 | X4.5 78.82,5.79 76.84,5.71 66.32,5.71 X2.5 | X5.5 7.9,5.4 17.14,5.4 18.93,5.59 X7.5 21.87,5.71 33.65,5.4 34.81,5.28 X6.5 37.42,5.4 48.26,5.4 49.29,5.79 X3.5 | 36.2,7.62 34.61,8.89 v33.02,10.48 | v43.18,15.56 C5.2

### Text on the board
bPlace: D15 | RST | GND | 5V | D16 | D14 | PULL-UPS | POWER | A5 | SPACE | CLICK | D5 | A4 | D4 | A3 | ARROWS | D3 | A2 | D2 | A1 | D1 | A0 | D0
bNames: click | space | right | left | down | up